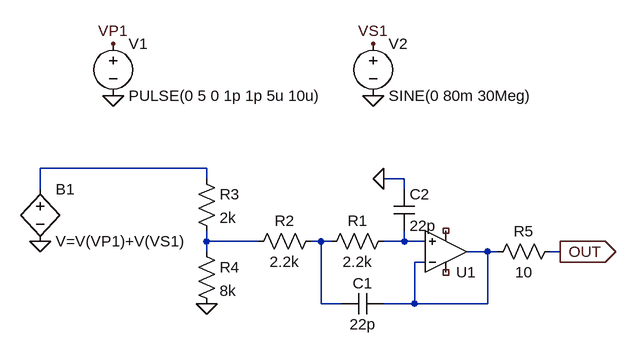
[diagram p0: schematic SQR_FG_2ndVCVS_LPF.asc]
SQR_FG_2ndVCVS_LPF.asc, the LTspice schematic file:
Version 4
SHEET 1 880 680
WIRE -96 32 -352 32
WIRE -96 48 -96 32
WIRE 208 48 176 48
WIRE -352 64 -352 32
WIRE 208 64 208 48
WIRE -96 144 -96 128
WIRE -16 144 -96 144
WIRE 80 144 64 144
WIRE 96 144 80 144
WIRE 208 144 208 128
WIRE 208 144 176 144
WIRE 240 144 208 144
WIRE -96 160 -96 144
WIRE 336 160 304 160
WIRE 352 160 336 160
WIRE 448 160 432 160
WIRE 240 176 224 176
WIRE 80 240 80 144
WIRE 112 240 80 240
WIRE 224 240 224 176
WIRE 224 240 176 240
WIRE 336 240 336 160
WIRE 336 240 224 240
FLAG -96 240 0
FLAG 176 48 0
FLAG 448 160 OUT
IOPIN 448 160 Out
FLAG -352 144 0
FLAG -240 -80 0
FLAG -240 -160 VP1
FLAG 160 -160 VS1
FLAG 160 -80 0
SYMBOL Opamps\\UniversalOpamp2 272 160 M180
SYMATTR InstName U1
SYMBOL res 192 128 R90
WINDOW 0 0 56 VBottom 2
WINDOW 3 32 56 VTop 2
SYMATTR InstName R1
SYMATTR Value 2.2k
SYMBOL res 80 128 R90
WINDOW 0 0 56 VBottom 2
WINDOW 3 32 56 VTop 2
SYMATTR InstName R2
SYMATTR Value 2.2k
SYMBOL res -112 32 R0
SYMATTR InstName R3
SYMATTR Value 2k
SYMBOL res -112 144 R0
SYMATTR InstName R4
SYMATTR Value 8k
SYMBOL cap 176 224 R90
WINDOW 0 0 32 VBottom 2
WINDOW 3 32 32 VTop 2
SYMATTR InstName C1
SYMATTR Value 22p
SYMBOL cap 192 64 R0
SYMATTR InstName C2
SYMATTR Value 22p
SYMBOL res 448 144 R90
WINDOW 0 0 56 VBottom 2
WINDOW 3 32 56 VTop 2
SYMATTR InstName R5
SYMATTR Value 10
SYMBOL bv -352 48 R0
SYMATTR InstName B1
SYMATTR Value V=V(VP1)+V(VS1)
SYMBOL voltage -240 -176 R0
WINDOW 123 0 0 Left 2
WINDOW 39 0 0 Left 2
SYMATTR InstName V1
SYMATTR Value PULSE(0 5 0 1p 1p 5u 10u)
SYMBOL voltage 160 -176 R0
WINDOW 123 0 0 Left 2
WINDOW 39 0 0 Left 2
SYMATTR InstName V2
SYMATTR Value SINE(0 80m 30Meg)

The netlist it stands for:
* SQR_FG_2ndVCVS_LPF.asc
XU1 N004 N005 NC_01 NC_02 N005 level.2 Avol=1Meg GBW=10Meg Slew=10Meg ilimit=25m rail=0 Vos=0 phimargin=45 en=0 enk=0 in=0 ink=0 Rin=500Meg  ; pins IN+ IN- V+ V- OUT
R1 N004 N003 2.2k
R2 N003 N002 2.2k
R3 N001 N002 2k
R4 N002 0 8k
C1 N005 N003 22p
C2 0 N004 22p
R5 OUT N005 10
B1 N001 0 V=V(VP1)+V(VS1)
V1 VP1 0 PULSE(0 5 0 1p 1p 5u 10u)
V2 VS1 0 SINE(0 80m 30Meg)
.lib UniversalOpamps2.sub
.backanno
.end